# Altium schematic sheet 0D1_(L293D).SchDoc
size A4
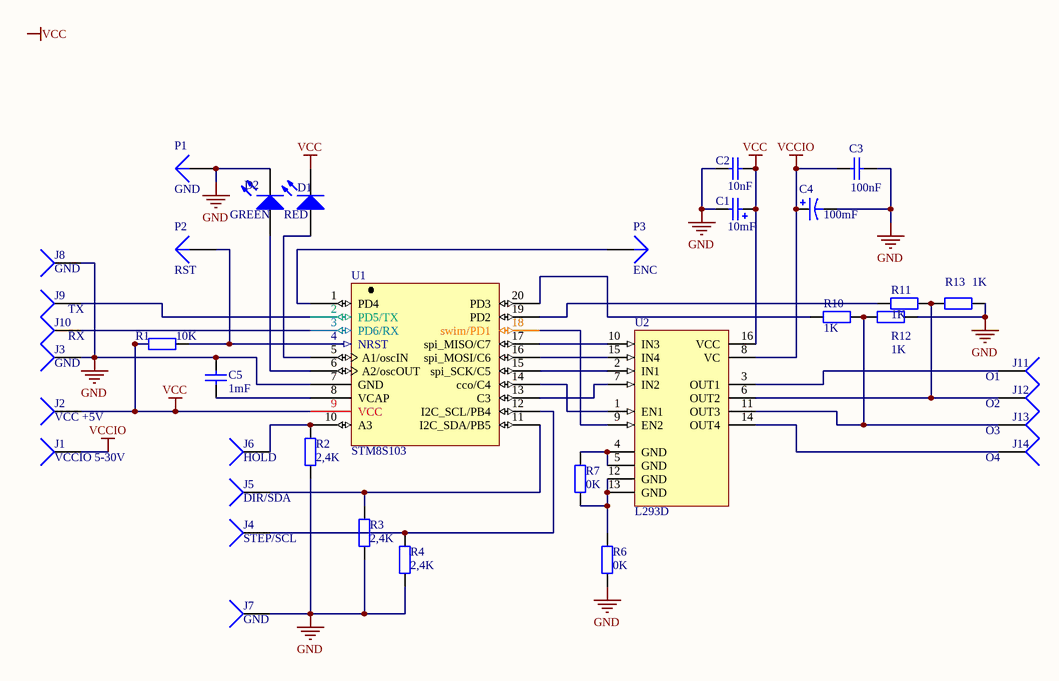
[diagram p0: 0D1_(L293D).SchDoc]

## Parts
C1  value 10mF  [0805]
C2  value 10nF  [0805]  (hidden comment: Cap)
C3  value 100nF  [0805]  (hidden comment: Cap)
C4  value 100mF  [RB5-10.5]  (hidden comment: Cap Pol1)
C5  value 1mF  [0805]  (hidden comment: Cap)
D1  RED  [3.5X2.8X1.9]
D2  GREEN  [3.5X2.8X1.9]
J1  VCCIO 5-30V  [PIN1]
J2  VCC +5V  [PIN1]
J3  GND  [PIN1]
J4  STEP/SCL  [PIN1]
J5  DIR/SDA  [PIN1]
J6  HOLD  [PIN1]
J7  GND  [PIN1]
J8  GND  [PIN1]
J9  TX  [PIN1]
J10  RX  [PIN1]
J11  O1  [PIN1]
J12  O2  [PIN1]
J13  O3  [PIN1]
J14  O4  [PIN1]
P1  GND  [PIN1]
P2  RST  [PIN1]
P3  ENC  [PIN1]
R1  value 10K  [0805]  (hidden comment: Res2)
R2  value 2,4K  [0805]  (hidden comment: Res2)
R3  value 2,4K  [0805]  (hidden comment: Res2)
R4  value 2,4K  [0805]  (hidden comment: Res2)
R6  value 0K  [1206]  (hidden comment: Res2)
R7  value 0K  [1812]  (hidden comment: Res2)
R10  value 1K  [RESC0805(2012)_M]  (hidden comment: Res2)
R11  value 1K  [RESC0805(2012)_M]  (hidden comment: Res2)
R12  value 1K  [RESC0805(2012)_M]  (hidden comment: Res2)
R13  value 1K  [RESC0805(2012)_M]  (hidden comment: Res2)
U1  STM8S103  [TSSOP20]
U2  L293D  [DIP16]

## Nets
GND: C1.2 C2.2 C3.2 C4.2 C5.1 D2.2(K) J3.1 J7.1 J8.1 P1.1 R2.2 R3.2 R4.2 R6.2 R12.2 R13.2 U1.7(GND)
VCC: C1.1 C2.1 D1.2(K) J2.1 R1.2 U1.9(VCC) U2.16(VCC)
VCCIO: C3.1 C4.1 J1.1 U2.8(VC)
NetC5_2: C5.2 U1.8(VCAP)
NetD1_1: D1.1(A) U1.5(A1/oscIN)
NetD2_1: D2.1(A) U1.6(A2/oscOUT)
NetJ4_1: J4.1 R4.1 U1.12(I2C_SCL/PB4)
NetJ5_1: J5.1 R3.1 U1.11(I2C_SDA/PB5)
NetJ6_1: J6.1 R2.1 U1.10(A3)
NetJ9_1: J9.1 U1.2(PD5/TX)
NetJ10_1: J10.1 U1.3(PD6/RX)
NetJ11_1: J11.1 U2.3(OUT1)
NetJ12_1: J12.1 R11.1 R13.1 U2.6(OUT2)
NetJ13_1: J13.1 R10.1 R12.1 U2.11(OUT3)
NetJ14_1: J14.1 U2.14(OUT4)
NetP2_1: P2.1 R1.1 U1.4(NRST)
NetP3_1: P3.1 U1.1(PD4)
NetR6_1: R6.1 R7.2 U2.12(GND) U2.13(GND)
NetR7_1: R7.1 U2.4(GND) U2.5(GND)
NetR10_2: R10.2 U1.20(PD3)
NetR11_2: R11.2 U1.19(PD2)
NetU1_13: U1.13(C3) U2.7(IN2)
NetU1_14: U1.14(cco/C4) U2.1(EN1)
NetU1_15: U1.15(spi_SCK/C5) U2.2(IN1)
NetU1_16: U1.16(spi_MOSI/C6) U2.15(IN4)
NetU1_17: U1.17(spi_MISO/C7) U2.10(IN3)
NetU1_18: U1.18(swim/PD1) U2.9(EN2)

## Notes on the sheet
- Labels drawn without touching a wire or pin: VCC

## Library data of the parts
C1 = Cap Pol2: Polarized Capacitor (Axial); Published: 8-Jun-2000; LatestRevisionDate: 17-Jul-2002; LatestRevisionNote: Re-released for DXP Platform.; PackageReference: C0805; Publisher: Altium Limited; PackageDescription: Polarized Capacitor; 2 Leads
C2 C3 C5 = Cap: Capacitor; Published: 8-Jun-2000; LatestRevisionDate: 17-Jul-2002; LatestRevisionNote: Re-released for DXP Platform.; PackageReference: C0805; Publisher: Altium Limited; PackageDescription: Radial Cap, Thru-Hole; 2 Leads; 0.3 in Pin Spacing
C4 = Cap Pol1: Polarized Capacitor (Radial); Published: 8-Jun-2000; LatestRevisionDate: 17-Jul-2002; LatestRevisionNote: Re-released for DXP Platform.; PackageReference: RB7.6-15; Publisher: Altium Limited; PackageDescription: Polarized Capacitor (Radial); 2 Leads
D1 D2 = LED3: Typical BLUE SiC LED; Published: 8-Jun-2000; LatestRevisionDate: 17-Dec-2003; LatestRevisionNote: PCB Footprint replaced.; DatasheetVersion: 16-Apr-2002; PackageVersion: 16-Apr-2002; PackageReference: 3.5X2.8X1.9; Publisher: Altium Limited; PackageDescription: SM LED; 2 C-Bend Leads; Body 3.5 x 2.8 x 1.9 mm, inc leads (LxWxH typ)
J1-J14 = Socket: LatestRevisionDate: 17-Jul-2002; LatestRevisionNote: Re-released for DXP Platform.; Publisher: Altium Limited
P1-P3 = Plug: LatestRevisionDate: 17-Jul-2002; LatestRevisionNote: Re-released for DXP Platform.; Publisher: Altium Limited
R1-R4 R6 R7 R10-R13 = Res2: Resistor; Published: 8-Jun-2000; LatestRevisionDate: 17-Jul-2002; LatestRevisionNote: Re-released for DXP Platform.; PackageReference: AXIAL-0.4; Publisher: Altium Limited; PackageDescription: Axial Device, Thru-Hole; 2 Leads; 0.4 in Pin Spacing
U2 = L293D: Push-Pull Four Channel Driver With Diode; Published: 8-Jun-2000; LatestRevisionDate: 06-Jun-2005; LatestRevisionNote: Stylized 3D Model Added.; DatasheetVersion: Jun-1996; PackageVersion: Apr-1996; PackageReference: DIP16; Publisher: Altium Limited; PackageDescription: DIP; 16 Leads; Row Spacing 7.62 mm; Pitch 2.54 mm; ComponentLink1Description: Manufacturer Link; ComponentLink1URL: http://www.st.com/; ComponentLink2Description: Datasheet; ComponentLink2URL: http://www.st.com/stonline/products/literature/ds/1330/l293d.pdf